# Altium schematic sheet LED_JTAG.schdoc
size 297 x 210 mm; Symbol: Sheet-Symbol_A4; Company: 嘉立创EDA; Version: V1.0; Page Size: A4; @Project Name: prj_extend_and_core_board_7_8; @Page Count: 7; @Update Date: 2024-08-12; @Create Date: 2024-08-09; @Schematic Name: Schematic1; @Page No: 6; @Page Name: LED/JTAG; Device: Sheet-Symbol_A4
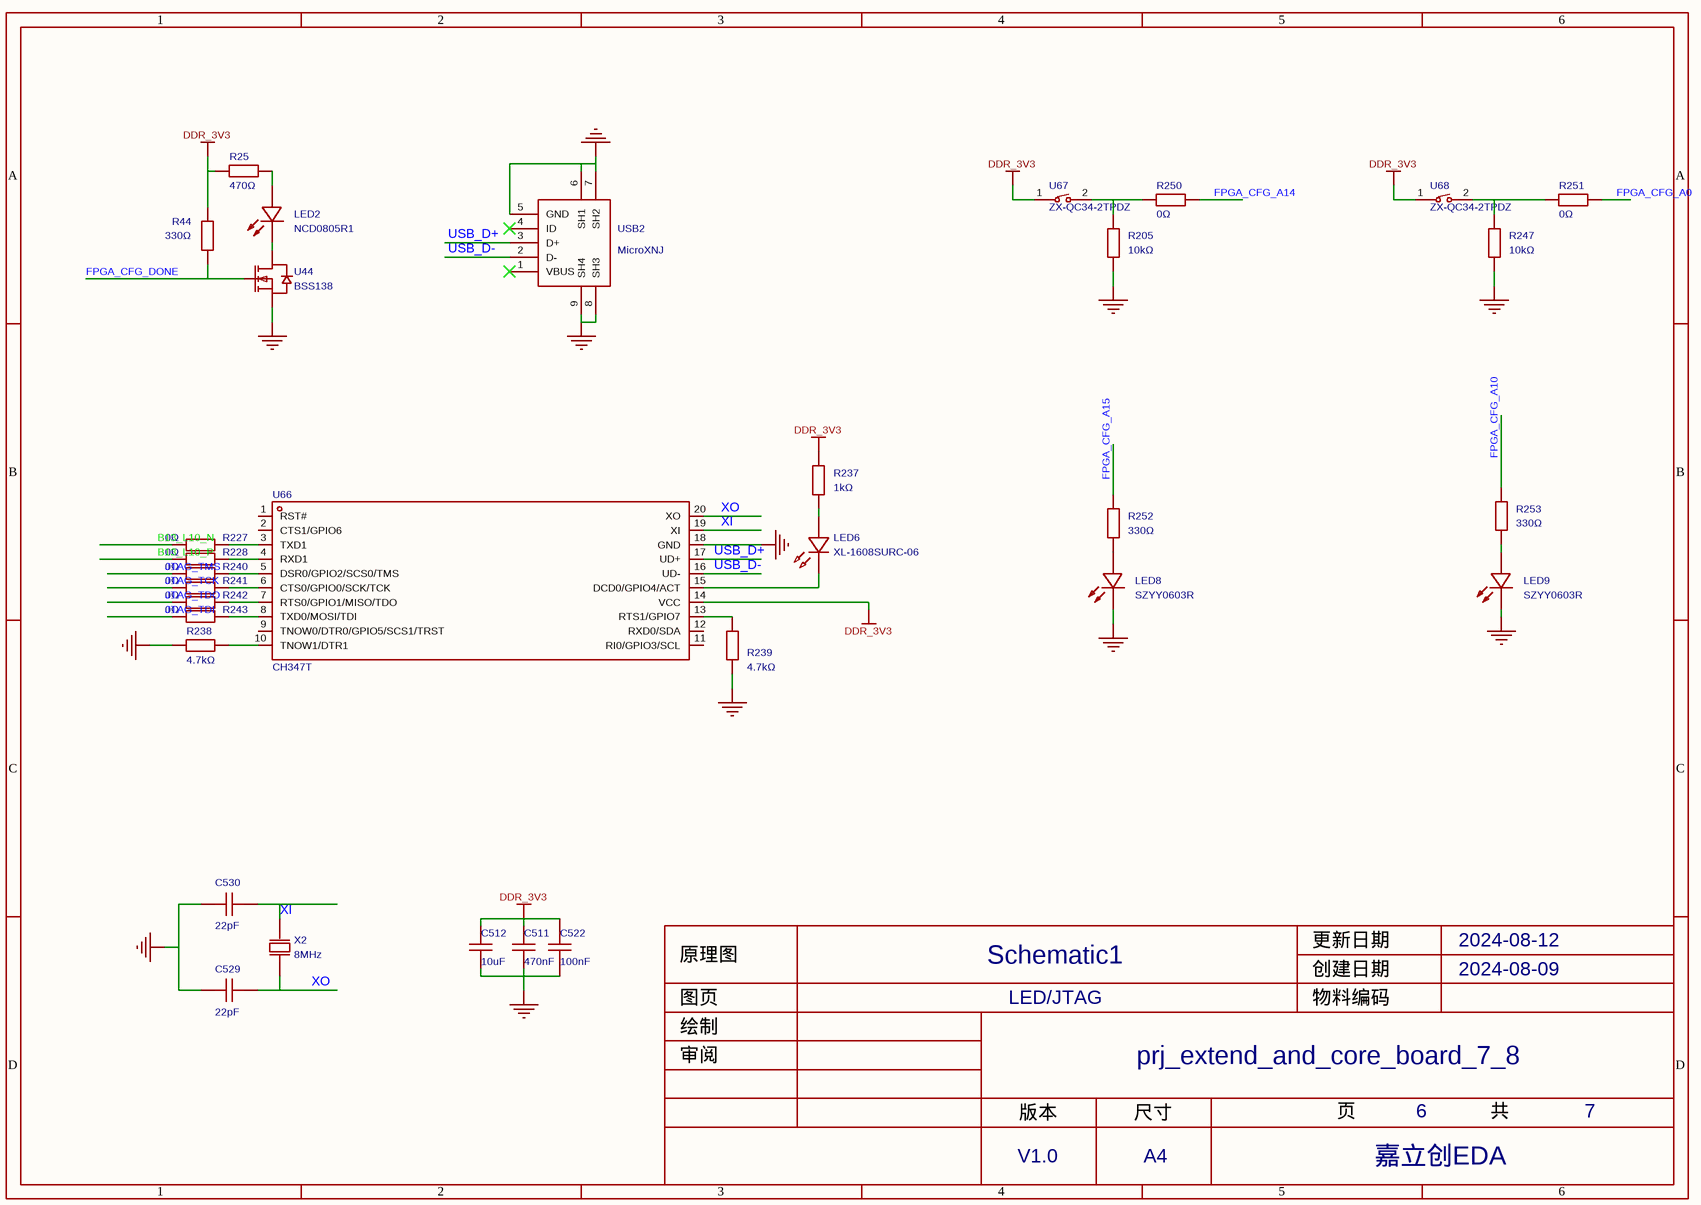
[diagram p0: LED_JTAG.schdoc]

## Parts
C511  470nF  [C0402]
C512  10uF  [C0402]
C522  100nF  [C0402]
C529  22pF  [C0402]
C530  22pF  [C0402]
LED2  NCD0805R1  [LED0805-R-RD]
LED6  XL-1608SURC-06  [LED0603-RD_RED]
LED8  SZYY0603R  [LED0603-R-RD]
LED9  SZYY0603R  [LED0603-R-RD]
R25  470Ω  [R0603]
R44  330Ω  [R0603]
R205  10kΩ  [R0603]
R227  0Ω  [R0402]
R228  0Ω  [R0402]
R237  1kΩ  [R0402]
R238  4.7kΩ  [R0402]
R239  4.7kΩ  [R0402]
R240  0Ω  [R0402]
R241  0Ω  [R0402]
R242  0Ω  [R0402]
R243  0Ω  [R0402]
R247  10kΩ  [R0603]
R250  0Ω  [R0402]
R251  0Ω  [R0402]
R252  330Ω  [R0402]
R253  330Ω  [R0402]
U44  BSS138  [SOT-23-3_L2.9-W1.3-P1.90-LS2.4-BR]
U66  CH347T  [TSSOP-20_L6.5-W4.4-P0.65-LS6.4-BL]
U67  ZX-QC34-2TPDZ  [KEY-SMD_L3.9-W3.0-LS5.0-EH]
U68  ZX-QC34-2TPDZ  [KEY-SMD_L3.9-W3.0-LS5.0-EH]
USB2  MicroXNJ  [MICRO-USB-SMD_MICROXNJ]
X2  8MHz  [CRYSTAL-SMD_L5.0-W3.2]

## Nets
DDR_3V3: C511.2 C512.2 C522.2 R25.2 R44.2 R237.2 U66.14(VCC) U67.1 U68.1
GND: C511.1 C512.1 C522.1 C529.2 C530.2 LED8.2(-) LED9.2(-) R205.1 R238.1 R239.1 R247.1 U44.2(S) U66.18(GND) USB2.5(GND) USB2.6(SH1) USB2.7(SH2) USB2.8(SH3) USB2.9(SH4)
B13_L10_N: R227.2
B13_L10_P: R228.2
FPGA_CFG_A0: R251.2
FPGA_CFG_A10: R253.2
FPGA_CFG_A14: R250.2
FPGA_CFG_A15: R252.2
FPGA_CFG_DONE: R44.1 U44.1(G)
JTAG_TCK: R241.2
JTAG_TDI: R243.2
JTAG_TDO: R242.2
JTAG_TMS: R240.2
USB_D+: U66.17(UD+) USB2.3(D+)
USB_D-: U66.16(UD-) USB2.2(D-)
XI: C530.1 U66.19(XI) X2.2(OSC2)
XO: C529.1 U66.20(XO) X2.1(OSC1)
NetLED2_1: LED2.1(+) R25.1
NetLED2_2: LED2.2(-) U44.3(D)
NetLED6_1: LED6.1(K) U66.15(DCD0/GPIO4/ACT)
NetLED6_2: LED6.2(A) R237.1
NetLED8_1: LED8.1(+) R252.1
NetLED9_1: LED9.1(+) R253.1
NetR205_2: R205.2 R250.1 U67.2
NetR227_1: R227.1 U66.3(TXD1)
NetR228_1: R228.1 U66.4(RXD1)
NetR238_2: R238.2 U66.10(TNOW1/DTR1)
NetR239_2: R239.2 U66.13(RTS1/GPIO7)
NetR240_1: R240.1 U66.5(DSR0/GPIO2/SCS0/TMS)
NetR241_1: R241.1 U66.6(CTS0/GPIO0/SCK/TCK)
NetR242_1: R242.1 U66.7(RTS0/GPIO1/MISO/TDO)
NetR243_1: R243.1 U66.8(TXD0/MOSI/TDI)
NetR247_2: R247.2 R251.1 U68.2

Not connected (* = marked no-connect by the designer): U66 1(RST#) 2(CTS1/GPIO6) 9(TNOW0/DTR0/GPIO5/SCS1/TRST) 11(RI0/GPIO3/SCL) 12(RXD0/SDA); USB2 1(VBUS)* 4(ID)*

## Notes on the sheet
- 1
- 2
- 3
- 4
- 5
- 6
- A
- B
- C
- 更新日期
- 2024-08-12
- 原理图
- 图页
- Schematic1
- LED/JTAG
- 创建日期
- 物料编码
- 2024-08-09
- D
- 审阅
- 绘制
- prj_extend_and_core_board_7_8
- 版本
- V1.0
- 尺寸
- A4
- 页
- 嘉立创EDA
- 共
- 7

## Library data of the parts
C511 = CL05A474KP5NNNC: 容值:470nF;精度:±10%;额定电压:10V;材质(温度系数):X5R;; Manufacturer: SAMSUNG(三星); AddInBom: yes; ModelId: 36a51122f27c49738f86b3bfa98863e0; ModelName: C0402_L1.0-W0.5-H0.5; ModelTransform: 39.37,19.685,0,0,0,0,0,0,0; Tolerance: ±10%; Voltage Rated: 10V; Temperature Coefficient: X5R; Symbol: CL05A474KP5NNNC; Device: CL05A474KP5NNNC; LCSC Part Name: 470nF ±10% 10V; SupplierPart: C47339; ManufacturerPart: CL05A474KP5NNNC; Supplier Footprint: 0402; JLCPCB Part Class: 扩展库; Datasheet: https://atta.szlcsc.com/upload/public/pdf/source/20160218/1457707763339.pdf; Supplier: LCSC; ConvertToPcb: yes; FootprintName: C0402; Value: 470nF
C512 = CL05A106MQ5NUNC: 容值:10uF;精度:±20%;额定电压:6.3V;材质(温度系数):X5R;; Manufacturer: SAMSUNG(三星); AddInBom: yes; ModelId: 36a51122f27c49738f86b3bfa98863e0; ModelName: C0402_L1.0-W0.5-H0.5; ModelTransform: 39.37,19.685,0,0,0,0,0,0,0; Tolerance: ±20%; Voltage Rated: 6.3V; Temperature Coefficient: X5R; Symbol: CL05A106MQ5NUNC; Device: CL05A106MQ5NUNC; Supplier: LCSC; Manufacturer Part: CL05A106MQ5NUNC; Value: 10uF; Supplier Part: C15525; JLCPCB Part Class: 基础库; LCSC Part Name: 10uF ±20% 6.3V; Supplier Footprint: 0402; Datasheet: https://atta.szlcsc.com/upload/public/pdf/source/20220823/2B02EE04F8F211D38A52DCB16EB6BEBA.pdf; ConvertToPcb: yes; FootprintName: C0402
C522 = GRM155R71C104KA88D: 容值:100nF;精度:±10%;额定电压:16V;材质(温度系数):X7R;; Manufacturer: muRata(村田); AddInBom: yes; ModelId: 36a51122f27c49738f86b3bfa98863e0; ModelName: C0402_L1.0-W0.5-H0.5; ModelTransform: 39.37,19.685,0,0,0,0,0,0,0; Tolerance: ±10%; Voltage Rated: 16V; Temperature Coefficient: X7R; Symbol: GRM155R71C104KA88D; Device: GRM155R71C104KA88D; LCSC Part Name: 100nF ±10% 16V; SupplierPart: C71629; ManufacturerPart: GRM155R71C104KA88D; Supplier Footprint: 0402; JLCPCB Part Class: 扩展库; Datasheet: https://atta.szlcsc.com/upload/public/pdf/source/20161108/1478586448742.pdf; Supplier: LCSC; ConvertToPcb: yes; FootprintName: C0402; Value: 100nF
C529 C530 = CC0402FRNPO9BN220: 容值:22pF;精度:±1%;额定电压:50V;材质(温度系数):NP0;; Manufacturer: YAGEO(国巨); AddInBom: yes; ModelId: 36a51122f27c49738f86b3bfa98863e0; ModelName: C0402_L1.0-W0.5-H0.5; ModelTransform: 39.37,19.685,0,0,0,0,0,0,0; Tolerance: ±1%; Voltage Rated: 50V; Temperature Coefficient: NP0; Symbol: CC0402FRNPO9BN220; Device: CC0402FRNPO9BN220; Supplier: LCSC; Supplier Part: C277482; Manufacturer Part: CC0402FRNPO9BN220; Value: 22pF; JLCPCB Part Class: 扩展库; LCSC Part Name: 22pF ±1% 50V; Supplier Footprint: 0402; Datasheet: https://atta.szlcsc.com/upload/public/pdf/source/20181008/C309499_21CC21451B82C39E3D92150FD6B30293.pdf; ConvertToPcb: yes; FootprintName: C0402
LED2 = NCD0805R1: 灯头类型:-;发光颜色:红色;正向电压(VF):1.6V~2.6V;功率:65mW;正向电流:20mA;主波长:615nm~630nm;二极管配置:独立二极管;透镜颜色:无色透明透镜;色温:-;发光强度:67mcd~195mcd;发光角度:130°;载带方式:-;工作温度:-30℃~+85℃;; Manufacturer: 国星光电; Symbol: FC-2012HRK-620D; AddInBom: yes; ModelId: 6ccd75a2b5134d6ab756ecf3c14a7290; ModelName: LED0805-RD; ModelTransform: 79.527,49.2125,0,0,0,0,0,0,0; Emitted Color: 红色; Power Dissipation: 65mW; Forward Current: 20mA; Diode Configuration: 独立二极管; Lens Color: 无色透明透镜; Viewing Angle: 130°; Device: NCD0805R1; Supplier: LCSC; Manufacturer Part: NCD0805R1; Supplier Part: C84256; JLCPCB Part Class: 基础库; LCSC Part Name: NCD0805R1; Supplier Footprint: 0805; Datasheet: https://atta.szlcsc.com/upload/public/pdf/source/20200820/C84256_F0A75A43B3EAD75808600A0514C76B99.pdf; ConvertToPcb: yes; FootprintName: LED0805-R-RD; Lamp Holder Type: -; Forward Voltage (VF): 1.6V~2.6V; Dominant Wavelength: 615nm~630nm; Peak Wavelength: -; Color Temperature: -; Luminous Intensity: 67mcd~195mcd; Mounting Sytle: -; Operating Temperature: -30℃~+85℃
LED6 = XL-1608SURC-06: 发光颜色:红色;功率:55mW;正向电流:25mA;主波长:617nm~621nm;透镜颜色:无色透明透镜;色温:-;发光角度:120°;载带方式:正贴;工作温度:-30℃~+85℃;; Manufacturer: XINGLIGHT(成兴光); AddInBom: yes; ModelId: 74041d3a270d435c8600a9ab9b7641c0; ModelTransform: 63.7794,31.496,0,0,0,0,0,0,0; Emitted Color: 红色; Power Dissipation: 55mW; Forward Current: 25mA; Peak Wavelength: 623nm; Lens Color: 无色透明透镜; Viewing Angle: 120°; Mounting Sytle: 正贴; Symbol: XL-1608SURC-06; Device: XL-1608SURC-06; Supplier: LCSC; Supplier Part: C965799; Manufacturer Part: XL-1608SURC-06; JLCPCB Part Class: 扩展库; LCSC Part Name: XL-1608SURC-06; Supplier Footprint: 0603; Datasheet: https://atta.szlcsc.com/upload/public/pdf/source/20221102/D860AFDD1CDB02C5A8064103A32707E2.pdf; ConvertToPcb: yes; FootprintName: LED0603-RD_RED; ModelName: LED0603-RD_RED; Dominant Wavelength: 617nm~621nm; Color Temperature: -; Operating Temperature: -30℃~+85℃
LED8 LED9 = SZYY0603R: 发光颜色:红色;功率:40mW;正向电流:20mA;主波长:615nm~630nm;二极管配置:-;透镜颜色:无色透明透镜;色温:-;发光角度:120°;载带方式:-;工作温度:-40℃~+85℃;; Manufacturer: yongyu(永裕光电); AddInBom: yes; ModelId: 8d3b40c214c440ee9cb5435c7b23d347; ModelTransform: 63.7794,31.496,0,0,0,0,0,0,0; Emitted Color: 红色; Power Dissipation: 40mW; Forward Current: 20mA; Peak Wavelength: 645nm; Lens Color: 无色透明透镜; Viewing Angle: 120°; Symbol: SZYY0603R; Device: SZYY0603R; LCSC Part Name: 红灯; SupplierPart: C434419; ManufacturerPart: SZYY0603R; Supplier Footprint: 0603; JLCPCB Part Class: 扩展库; Datasheet: https://atta.szlcsc.com/upload/public/pdf/source/20191204/C434419_0B955C1F73FF88449D9A795B6FF49070.pdf; Supplier: LCSC; ConvertToPcb: yes; FootprintName: LED0603-R-RD; ModelName: LED0603-R-RD; Dominant Wavelength: 615nm~630nm; Diode Configuration: -; Color Temperature: -; Mounting Sytle: -; Operating Temperature: -40℃~+85℃
R25 = 0603WAF4700T5E: 电阻类型:厚膜电阻;阻值:470Ω;精度:±1%;功率:100mW;最大工作电压:75V;温度系数:±100ppm/℃;; Manufacturer: UNI-ROYAL(厚声); AddInBom: yes; ModelId: fc143cca1e79419f9cd78b61e9279f08; ModelTransform: 31.8897,63.7794,0,90,0,0,0,0,0; Tolerance: ±1%; Power(Watts): 100mW; Overload Voltage (Max): 75V; Symbol: 0603WAF4700T5E; Device: 0603WAF4700T5E; Supplier: LCSC; Manufacturer Part: 0603WAF4700T5E; Supplier Part: C23179; Value: 470Ω; JLCPCB Part Class: 基础库; LCSC Part Name: 470Ω ±1% 100mW 厚膜电阻; Supplier Footprint: 0603; Datasheet: https://atta.szlcsc.com/upload/public/pdf/source/20200306/C422600_1E6D84923E4A46A82E41ADD87F860B5C.pdf; ConvertToPcb: yes; FootprintName: R0603; ModelName: R0603; Type: 厚膜电阻; Temperature Coefficient: ±100ppm/℃; Operating Temperature Range: -55℃~+155℃
R44 = 0603WAF3300T5E: 电阻类型:厚膜电阻;阻值:330Ω;精度:±1%;功率:100mW;最大工作电压:75V;温度系数:±100ppm/℃;; Manufacturer: UNI-ROYAL(厚声); AddInBom: yes; ModelId: fc143cca1e79419f9cd78b61e9279f08; ModelTransform: 31.8897,63.7794,0,90,0,0,0,0,0; Tolerance: ±1%; Power(Watts): 100mW; Overload Voltage (Max): 75V; Symbol: 0603WAF3300T5E; Device: 0603WAF3300T5E; Supplier: LCSC; Manufacturer Part: 0603WAF3300T5E; Supplier Part: C23138; Value: 330Ω; JLCPCB Part Class: 基础库; LCSC Part Name: 330Ω ±1% 100mW 厚膜电阻; Supplier Footprint: 0603; Datasheet: https://atta.szlcsc.com/upload/public/pdf/source/20200306/C422600_1E6D84923E4A46A82E41ADD87F860B5C.pdf; ConvertToPcb: yes; FootprintName: R0603; ModelName: R0603; Type: 厚膜电阻; Temperature Coefficient: ±100ppm/℃; Operating Temperature Range: -55℃~+155℃
R205 R247 = 0603WAF1002T5E: 电阻类型:厚膜电阻;阻值:10kΩ;精度:±1%;功率:100mW;最大工作电压:75V;温度系数:±100ppm/℃;; Manufacturer: UNI-ROYAL(厚声); AddInBom: yes; ModelId: fc143cca1e79419f9cd78b61e9279f08; ModelTransform: 31.8897,63.7794,0,90,0,0,0,0,0; Tolerance: ±1%; Power(Watts): 100mW; Overload Voltage (Max): 75V; Symbol: 0603WAF1002T5E; Device: 0603WAF1002T5E; Supplier: LCSC; Manufacturer Part: 0603WAF1002T5E; Supplier Part: C25804; Value: 10kΩ; JLCPCB Part Class: 基础库; LCSC Part Name: 厚膜电阻 10kΩ ±1% 100mW; Supplier Footprint: 0603; Datasheet: https://atta.szlcsc.com/upload/public/pdf/source/20200306/C422600_1E6D84923E4A46A82E41ADD87F860B5C.pdf; ConvertToPcb: yes; FootprintName: R0603; ModelName: R0603; Type: 厚膜电阻; Temperature Coefficient: ±100ppm/℃; Operating Temperature Range: -55℃~+155℃
R227 R228 R240-R243 R250 R251 = 0402WGF0000TCE: 电阻类型:厚膜电阻;阻值:0Ω;精度:±1%;功率:62.5mW;最大工作电压:50V;温度系数:±800ppm/℃;; Manufacturer: UNI-ROYAL(厚声); AddInBom: yes; ModelId: 671aefced39d4c318694bba8bd8efd39; ModelName: R0402_L1.0-W0.5-H0.5; ModelTransform: 39.37,19.685,0,0,0,0,0,0.0005,0; Tolerance: ±1%; Power(Watts): 62.5mW; Overload Voltage (Max): 50V; Symbol: 0402WGF0000TCE; Device: 0402WGF0000TCE; Supplier: LCSC; Manufacturer Part: 0402WGF0000TCE; Supplier Part: C17168; Value: 0Ω; JLCPCB Part Class: 基础库; LCSC Part Name: 0Ω ±1% 62.5mW 厚膜电阻; Supplier Footprint: 0402; Datasheet: https://atta.szlcsc.com/upload/public/pdf/source/20200306/C422600_1E6D84923E4A46A82E41ADD87F860B5C.pdf; ConvertToPcb: yes; FootprintName: R0402; Type: 厚膜电阻; Temperature Coefficient: ±800ppm/℃; Operating Temperature Range: -55℃~+155℃
R237 = 0402WGF1001TCE: 电阻类型:厚膜电阻;阻值:1kΩ;精度:±1%;功率:62.5mW;最大工作电压:50V;温度系数:±100ppm/℃;; Manufacturer: UNI-ROYAL(厚声); AddInBom: yes; ModelId: 671aefced39d4c318694bba8bd8efd39; ModelName: R0402_L1.0-W0.5-H0.5; ModelTransform: 39.37,19.685,0,0,0,0,0,0.0005,0; Tolerance: ±1%; Power(Watts): 62.5mW; Overload Voltage (Max): 50V; Symbol: 0402WGF1001TCE; Device: 0402WGF1001TCE; Supplier: LCSC; Manufacturer Part: 0402WGF1001TCE; Supplier Part: C11702; Value: 1kΩ; JLCPCB Part Class: 基础库; LCSC Part Name: 1kΩ ±1% 62.5mW 厚膜电阻; Supplier Footprint: 0402; Datasheet: https://atta.szlcsc.com/upload/public/pdf/source/20200306/C422600_1E6D84923E4A46A82E41ADD87F860B5C.pdf; ConvertToPcb: yes; FootprintName: R0402; Type: 厚膜电阻; Temperature Coefficient: ±100ppm/℃; Operating Temperature Range: -55℃~+155℃
R238 R239 = 0402WGF4701TCE: 电阻类型:厚膜电阻;阻值:4.7kΩ;精度:±1%;功率:62.5mW;最大工作电压:50V;温度系数:±100ppm/℃;; Manufacturer: UNI-ROYAL(厚声); AddInBom: yes; ModelId: 671aefced39d4c318694bba8bd8efd39; ModelName: R0402_L1.0-W0.5-H0.5; ModelTransform: 39.37,19.685,0,0,0,0,0,0.0005,0; Tolerance: ±1%; Power(Watts): 62.5mW; Overload Voltage (Max): 50V; Symbol: 0402WGF4701TCE; Device: 0402WGF4701TCE; Supplier: LCSC; Manufacturer Part: 0402WGF4701TCE; Supplier Part: C25900; Value: 4.7kΩ; JLCPCB Part Class: 基础库; LCSC Part Name: 4.7kΩ ±1% 62.5mW 厚膜电阻; Supplier Footprint: 0402; Datasheet: https://atta.szlcsc.com/upload/public/pdf/source/20200306/C422600_1E6D84923E4A46A82E41ADD87F860B5C.pdf; ConvertToPcb: yes; FootprintName: R0402; Type: 厚膜电阻; Temperature Coefficient: ±100ppm/℃; Operating Temperature Range: -55℃~+155℃
R252 R253 = 0402WGF3300TCE: 电阻类型:厚膜电阻;阻值:330Ω;精度:±1%;功率:62.5mW;最大工作电压:50V;温度系数:±100ppm/℃;; Manufacturer: UNI-ROYAL(厚声); AddInBom: yes; ModelId: 671aefced39d4c318694bba8bd8efd39; ModelName: R0402_L1.0-W0.5-H0.5; ModelTransform: 39.37,19.685,0,0,0,0,0,0.0005,0; Tolerance: ±1%; Power(Watts): 62.5mW; Overload Voltage (Max): 50V; Symbol: 0402WGF3300TCE; Device: 0402WGF3300TCE; Supplier: LCSC; Manufacturer Part: 0402WGF3300TCE; Supplier Part: C25104; Value: 330Ω; JLCPCB Part Class: 基础库; LCSC Part Name: 330Ω ±1% 62.5mW 厚膜电阻; Supplier Footprint: 0402; Datasheet: https://atta.szlcsc.com/upload/public/pdf/source/20200306/C422600_1E6D84923E4A46A82E41ADD87F860B5C.pdf; ConvertToPcb: yes; FootprintName: R0402; Type: 厚膜电阻; Temperature Coefficient: ±100ppm/℃; Operating Temperature Range: -55℃~+155℃
U44 = BSS138_C7420339: 类型:N沟道;漏源电压(Vdss):50V;连续漏极电流(Id):340mA;功率(Pd):350mW;导通电阻(RDS(on)@Vgs,Id):2.5Ω@10V,0.34A;阈值电压(Vgs(th)@Id):1.6V@250uA;; Manufacturer: 宏迦橙; AddInBom: yes; ModelId: c62791f0466c4ae2a892c056b845b0ca; ModelName: SOT-23-3P_L2.9-W1.3-H1.0-LS2.4-P0.95; ModelTransform: 98.425,114.173,0,180,0,0,0.0005,-0.0005,0; Drain Source Voltage (Vdss): 50V; Continuous Drain Current (Id): 340mA; Power Dissipation (Pd): 350mW; Total Gate Charge (Qg@Vgs): 1.7nC@10V; Input Capacitance (Ciss@Vds): 17.5pF@25V; Reverse Transfer Capacitance (Crss@Vds): 6.5pF@25V; Symbol: BSS138_C7420339; Device: BSS138_C7420339; Supplier: LCSC; Supplier Part: C7420339; Manufacturer Part: BSS138; JLCPCB Part Class: 扩展库; LCSC Part Name: N沟道 耐压:50V 电流:340mA; Supplier Footprint: SOT-23; Datasheet: https://atta.szlcsc.com/upload/public/pdf/source/20230828/FA091145E476A230936B8E03226CDB87.pdf; ConvertToPcb: yes; FootprintName: SOT-23-3_L2.9-W1.3-P1.90-LS2.4-BR; Type: N沟道; Drain Source On Resistance (RDS(on)@Vgs,Id): 2.5Ω@10V,0.34A; Gate Threshold Voltage (Vgs(th)@Id): 1.6V@250uA; Operating Temperature: -55℃~+150℃
U66 = CH347T: Manufacturer: WCH(南京沁恒); AddInBom: yes; ModelId: c491f68934b34c649df5890a1d97cd0f; ModelName: TSSOP-20_L6.5-W4.4-H1.0-LS6.4-P0.65; ModelTransform: 251.969,255.906,0,90,0,0,0.0005,0,0; Symbol: CH347T; Device: CH347T; LCSC Part Name: CH347T; SupplierPart: C5122332; ManufacturerPart: CH347T; Supplier Footprint: TSSOP-20; JLCPCB Part Class: 扩展库; Datasheet: https://atta.szlcsc.com/upload/public/pdf/source/20220727/C146BDC59808820E6CF38786842D37DD.pdf; Supplier: LCSC; ConvertToPcb: yes; FootprintName: TSSOP-20_L6.5-W4.4-P0.65-LS6.4-BL
U67 U68 = ZX-QC34-2TPDZ: 电路结构:单刀单掷;按钮形状:圆形按钮;作用力:2.6N;安装方式:立贴;开关长度:3mm;开关宽度:4mm;开关高度:2mm;带支架:不带;触点电流:50mA;额定电压(AC):250V;额定电压(DC):12V;绝缘电阻:100MΩ;机械寿命:10万次;; Manufacturer: Megastar(兆星); AddInBom: yes; ModelId: 887c37aacc9c4feb87b9442b15e50881; ModelTransform: 196.85,118.5037,0,0,0,0,0,0,-19.685; Circuit: 单刀单掷; Actuator Style: 圆形按钮; Operating Force: 2.6N; Switch Length: 3mm; Switch Width: 4mm; Switch Height: 2mm; Strike Gundam: 不带; Contact Current: 50mA; Voltage Rating (AC): 250V; Voltage Rating (DC): 12V; Insulation Resistance: 100MΩ; Actuator/Cap Color: 黑色; Pin Style: 鸥翼型; Mechanical Life: 10万次; Symbol: ZX-QC34-2TPDZ; Device: ZX-QC34-2TPDZ; LCSC Part Name: 3*4*2贴片开关带柱; SupplierPart: C7470219; ManufacturerPart: ZX-QC34-2TPDZ; Supplier Footprint: SMD; JLCPCB Part Class: 扩展库; Datasheet: https://atta.szlcsc.com/upload/public/pdf/source/20230724/D2731FAADF93973E25928DE23F241F8A.pdf; Supplier: LCSC; ConvertToPcb: yes; FootprintName: KEY-SMD_L3.9-W3.0-LS5.0-EH; ModelName: KEY-SMD_L3.9-W3.0-LS5.0-EH; Mounting Style: 立贴; Operating Temperature: -30℃~+80℃
USB2 = MicroXNJ: 连接器类型:Micro-B;标准:USB 2.0;公母:母;端口数量:1;触点数量:5P;安装方式:卧贴;额定电流 - 电源:1A;工作温度范围:-20℃~+85℃;; Manufacturer: SHOU HAN(首韩); AddInBom: yes; ModelId: 09cd4e00f84d4aa48ba25c78094c25a1; ModelName: MICRO-USB-SMD_MICROXNJ-A; ModelTransform: 308.47812,229.61104,0,0,0,0,0,-60.039,-47.244; Gender: 母; Number of Ports: 1; Number of Contacts: 5P; Current Rating - Power (Max): 1A; Symbol: MICROXNJ; Device: MicroXNJ; Supplier: LCSC; Supplier Part: C404969; Manufacturer Part: MicroXNJ; JLCPCB Part Class: 扩展库; LCSC Part Name: Micro-B 母 卧贴; Supplier Footprint: SMD; Datasheet: https://atta.szlcsc.com/upload/public/pdf/source/20220415/2494EDFF499AF6F852F7C820374B6AF3.pdf; ConvertToPcb: yes; FootprintName: MICRO-USB-SMD_MICROXNJ; Connector Type: Micro-B; Standard: USB 2.0; Mounting Style: 卧贴; Operating Temperature Range: -20℃~+85℃
X2 = X50328MSB2GI: 晶振类型:贴片晶振;频率:8MHz;常温频差:±10ppm;外接负载电容:20pF;频率稳定度(全温):±20ppm;; Manufacturer: YXC(扬兴晶振); AddInBom: yes; ModelId: d7c39c66443246ff83c2003c1e1eb6f1; ModelTransform: 196.85,125.984,0,0,0,0,0,0,0; Crystal Type: 贴片晶振; Normal temperature Frequency Tolerance: ±10ppm; External load capacitor: 20pF; Frequency Stability(Full temperature range): ±20ppm; Symbol: X50328MSB2GI; Device: X50328MSB2GI; LCSC Part Name: 8MHz ±10ppm 20pF YSX530GA; SupplierPart: C115962; ManufacturerPart: X50328MSB2GI; Supplier Footprint: SMD5032; JLCPCB Part Class: 基础库; Datasheet: https://atta.szlcsc.com/upload/public/pdf/source/20240329/44922B0AF7B60E58E9B66993B6077277.pdf; Supplier: LCSC; ConvertToPcb: yes; FootprintName: CRYSTAL-SMD_L5.0-W3.2; ModelName: CRYSTAL-SMD_L5.0-W3.2; Value: 8MHz; Operating Temperature: -40℃~+85℃